# Altium schematic sheet Indicator.SchDoc
size A4
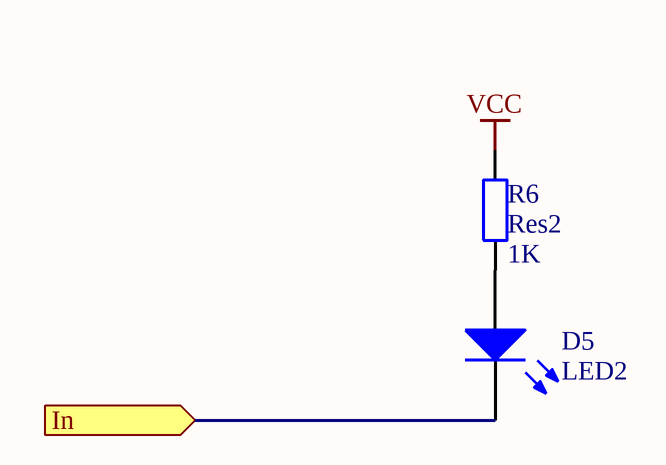
[diagram p0: Indicator.SchDoc]

## Parts
D5  LED2  [3.2X1.6X1.1]
R6  Res2  value 1K  [AXIAL-0.4]

## Ports
In (in)

## Nets
VCC: R6.2
In: D5.2(K) ; port In
NetD5_1: D5.1(A) R6.1

## Library data of the parts
D5 = LED2: Typical RED, GREEN, YELLOW, AMBER GaAs LED; Published: 8-Jun-2000; LatestRevisionDate: 17-Jul-2002; LatestRevisionNote: Re-released for DXP Platform.; PackageDocument: Feb-2002; PackageReference: 3.2X1.6X1.1; Publisher: Altium Limited
R6 = Res2: Resistor; Published: 8-Jun-2000; LatestRevisionDate: 17-Jul-2002; LatestRevisionNote: Re-released for DXP Platform.; PackageReference: AXIAL-0.4; Publisher: Altium Limited